# Altium project my_first_project.PrjPcb (part 3 of 3)

## Sheet POWER_Manegement.SchDoc: power manegement
size A3; Date: 23.01.2023; CompanyName: zonguldak BEU; Engineer: alperen; SheetNumber: 3; SheetTotal: 5; FIRST_PROJECT: *FIRST_PROJECT; PAGE_SİZE: *A3
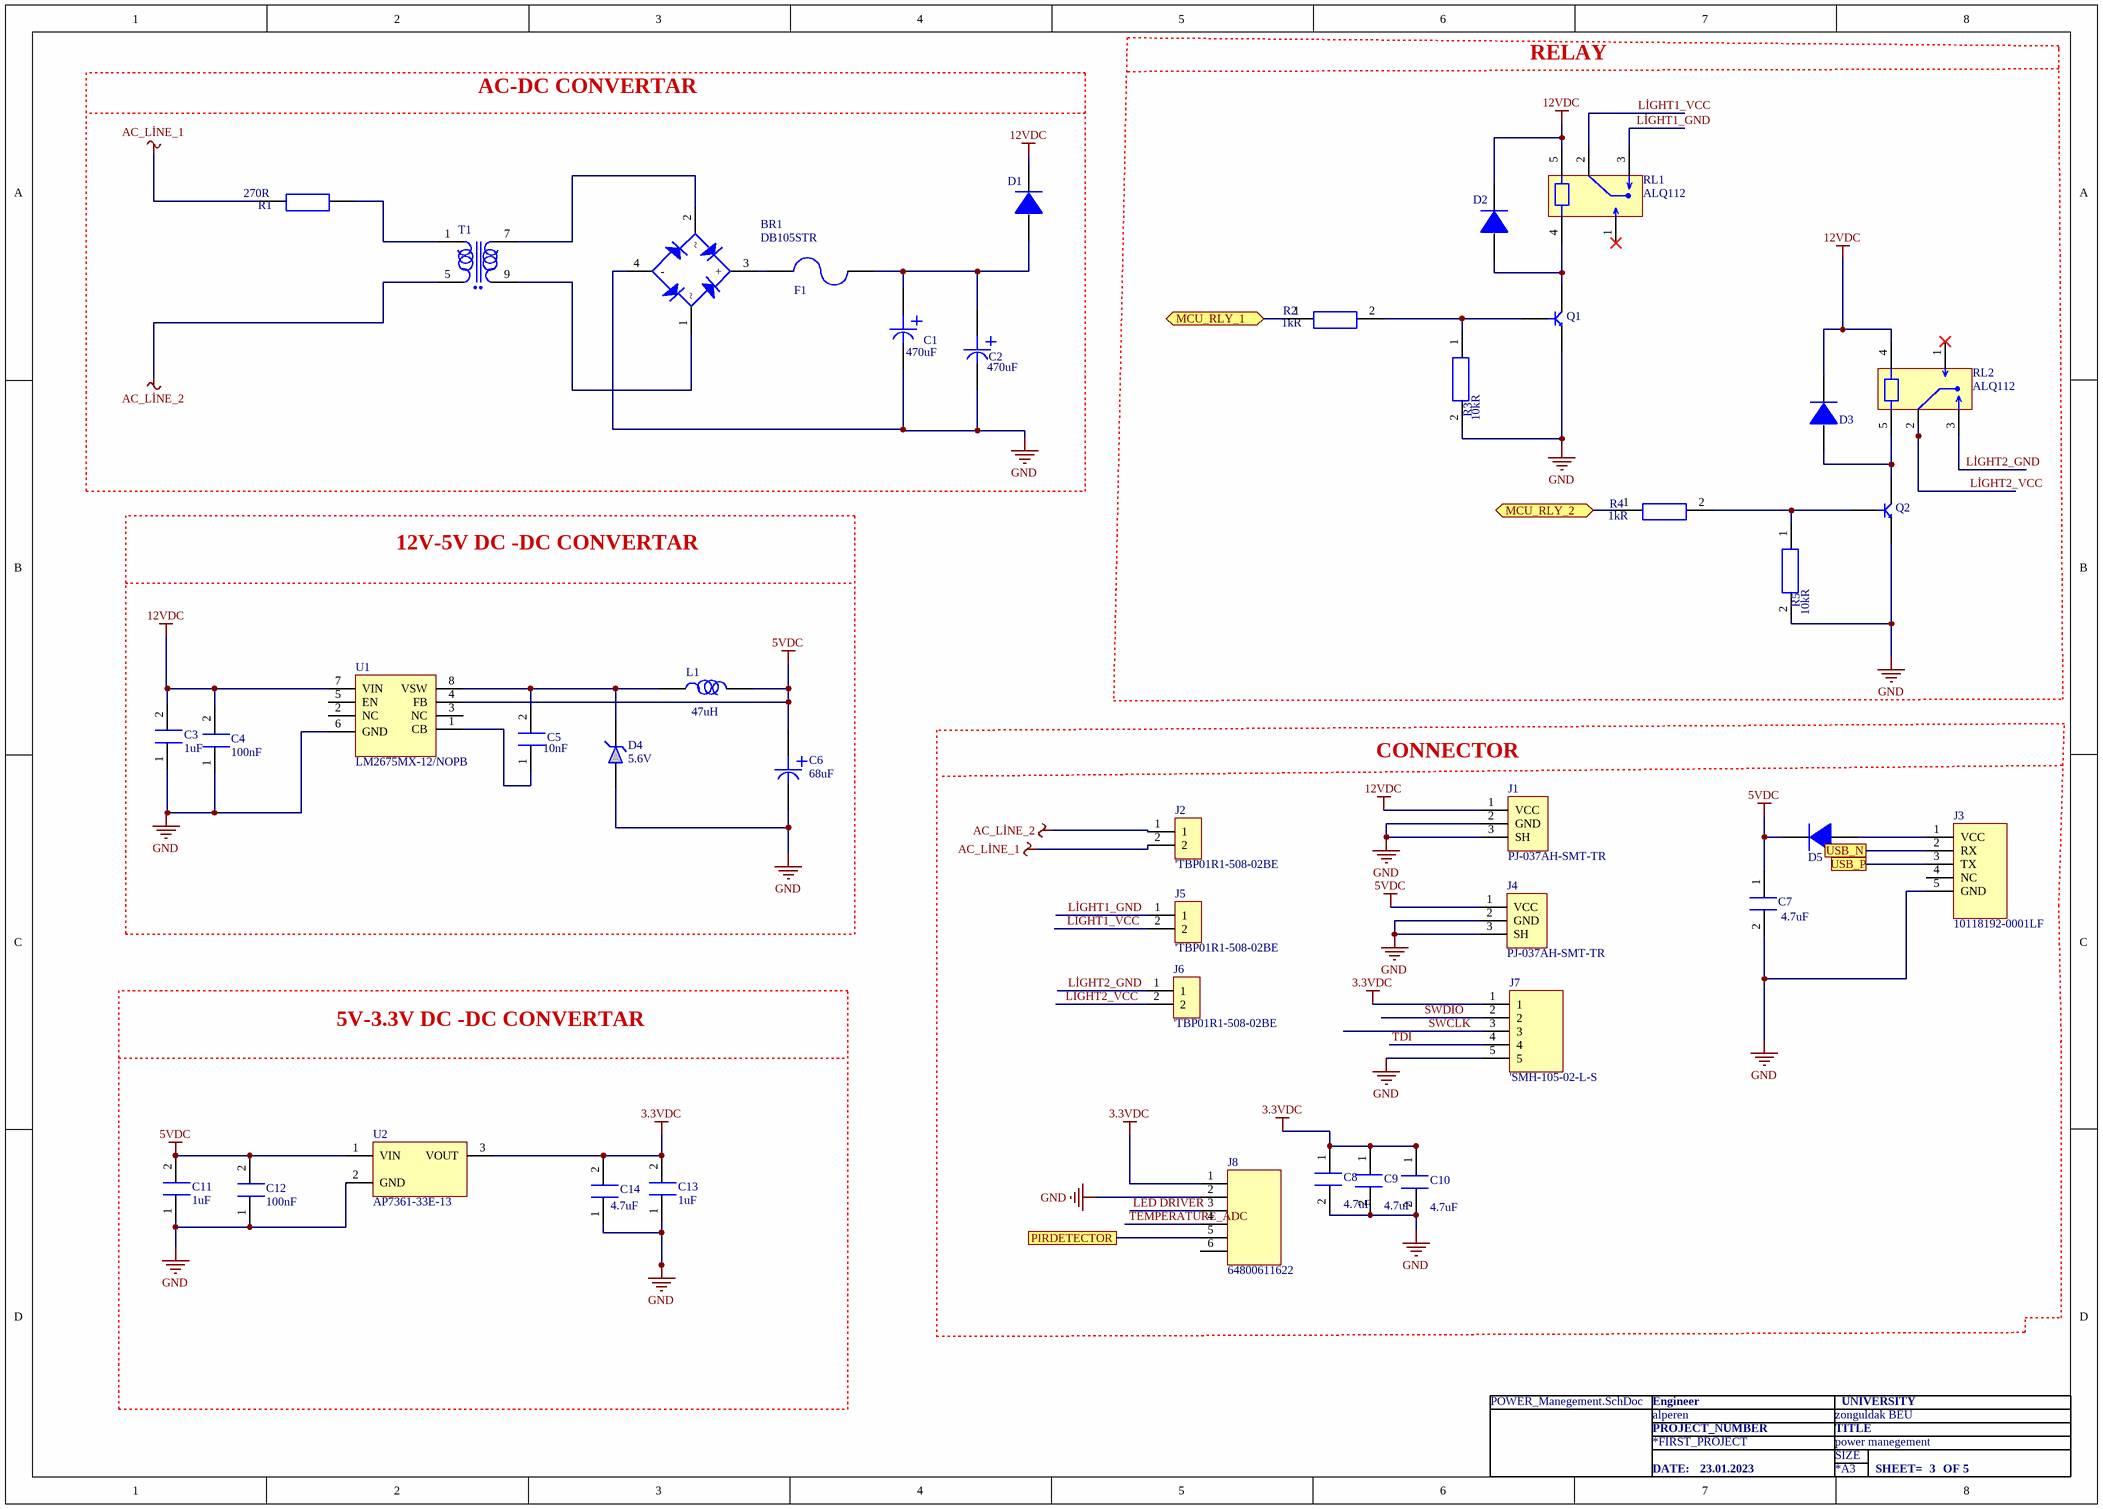
[diagram p4: POWER_Manegement.SchDoc]

### Parts
BR1  DB105STR  [DB105STR]
C1  Capacitance: 470uF  [CAP_RADIAL_D10_P5]  (hidden comment: ESH477M050AH4AA)
C2  Capacitance: 470uF  [CAP_RADIAL_D10_P5]  (hidden comment: ESH477M050AH4AA)
C3  Capacitance: 1uF  [CAP_0805]  (hidden comment: CAP CER 1UF 0805)
C4  Capacitance: 100nF  [CAP_0805]  (hidden comment: CAP CF 100NF 0805)
C5  Capacitance: 10nF  [CAP_0603]  (hidden comment: CAP CER 10nF 0603)
C6  Capacitance: 68uF  [CAP_EEVseries]  (hidden comment: EEV686M035A9HAA)
C7  Capacitance: 4.7uF  [CAP_0805]  (hidden comment: CAP CER 4.7uF 0805)
C8  Capacitance: 4.7uF  [CAP_0805]  (hidden comment: CAP CER 4.7uF 0805)
C9  Capacitance: 4.7uF  [CAP_0805]  (hidden comment: CAP CER 4.7uF 0805)
C10  Capacitance: 4.7uF  [CAP_0805]  (hidden comment: CAP CER 4.7uF 0805)
C11  Capacitance: 1uF  [CAP_0805]  (hidden comment: CAP CER 1UF 0805)
C12  Capacitance: 100nF  [CAP_0805]  (hidden comment: CAP CF 100NF 0805)
C13  Capacitance: 1uF  [CAP_0805]  (hidden comment: CAP CER 1UF 0805)
C14  Capacitance: 4.7uF  [CAP_0805]  (hidden comment: CAP CER 4.7uF 0805)
D1  1N4148WS  [SOD323]  (value not drawn)
D2  1N4148WS  [SOD323]  (value not drawn)
D3  1N4148WS  [SOD323]  (value not drawn)
D4  Zener Voltage: 5.6V  [SMB]  (hidden comment: 1SMB5919BT3G)
D5  1N4148WS  [SOD323]  (value not drawn)
F1  FUSE 3413.0216.22  [FUSE 3413.0216.22]  (value not drawn)
J1  PJ-037AH-SMT-TR  [JACK]
J2  'TBP01R1-508-02BE  ['TBP01R1-508]
J3  10118192-0001LF  [MICRO_B_USB]
J4  PJ-037AH-SMT-TR  [JACK]
J5  'TBP01R1-508-02BE  ['TBP01R1-508]
J6  'TBP01R1-508-02BE  ['TBP01R1-508]
J7  'SMH-105-02-L-S  [PINHEADER 1X5_RA]
J8  64800611622  [64800611622]
L1  Inductance: 47uH  [IND_1212]  (hidden comment: 78438335470)
Q1  MMBT3904-7-F  [SOT-23F]  (value not drawn)
Q2  MMBT3904-7-F  [SOT-23F]  (value not drawn)
R1  Resistance: 270R  [RES_AXIAL_W]  (hidden comment: RES_AXIAL_W)
R2  Resistance: 1kR  [RES_0603]  (hidden comment: RES_1KOHM)
R3  Resistance: 10kR  [RES_0603]  (hidden comment: RES 10KOHM%1 0603)
R4  Resistance: 1kR  [RES_0603]  (hidden comment: RES_1KOHM)
R5  Resistance: 10kR  [RES_0603]  (hidden comment: RES 10KOHM%1 0603)
RL1  ALQ112  [ALQ112]
RL2  ALQ112  [ALQ112]
T1  BV302S12010-ZU  [BV302S12010-ZU]  (value not drawn)
U1  LM2675MX-12/NOPB  [SOIC8]
U2  AP7361-33E-13  [SOT-223]

### Blocks framed on the sheet
RELAY: D2 D3 Q1 Q2 R2-R5 RL1 RL2
AC-DC CONVERTAR: BR1 C1 C2 D1 F1 R1 T1
12V-5V DC -DC CONVERTAR: C3-C6 D4 L1 U1
5V-3.3V DC -DC CONVERTAR: C11-C14 U2

### Ports
MCU_RLY_1 (bidir), MCU_RLY_2 (bidir), PIRDETECTOR, USB_N, USB_P

### Nets
3.3VDC: C8.1 C9.1 C10.1 C13.2 C14.2 J7.1 J8.1(VCC) U2.3(VOUT)
5VDC: C6.1 C7.1 C11.2 C12.2 D5.1 J4.1(VCC) L1.2 U1.4(FB) U2.1(VIN)
12VDC: C3.2 C4.2 D1.1 D2.1 D3.1 J1.1(VCC) RL1.5 RL2.4 U1.7(VIN)
AC_LİNE_1: J2.2 R1.1
AC_LİNE_2: J2.1 T1.5
GND: BR1.4(-) C1.2 C2.2 C3.1 C4.1 C6.2 C7.2 C8.2 C9.2 C10.2 C11.1 C12.1 C13.1 C14.1 D4.C J1.2(GND) J1.3(SH) J3.5(GND) J4.2(GND) J4.3(SH) J7.5 J8.2(RX) Q1.2(E) Q2.2(E) R3.2 R5.2 U1.6(GND) U2.2(GND)
LED DRIVER: J8.3(TX)
LİGHT1_GND: J5.1 RL1.3
LİGHT1_VCC: J5.2 RL1.2
LİGHT2_GND: J6.1 RL2.3
LİGHT2_VCC: J6.2 RL2.2
SWCLK: J7.3
SWDIO: J7.2
TDI: J7.4
TEMPERATURE_ADC: J8.4(NC)
USB_N: J3.2(RX) ; port USB_N
USB_P: J3.3(TX) ; port USB_P
NetBR1_1: BR1.1 T1.9
NetBR1_2: BR1.2 T1.7
NetBR1_3: BR1.3(+) F1.1
NetC1_1: C1.1 C2.1 D1.2 F1.2
NetC5_1: C5.1 U1.1(CB)
NetC5_2: C5.2 D4.A L1.1 U1.8(VSW)
NetD2_2: D2.2 Q1.3(C) RL1.4
NetD3_2: D3.2 Q2.3(C) RL2.5
NetD5_2: D5.2 J3.1(VCC)
NetJ8_5: J8.5(GND) ; port PIRDETECTOR
NetQ1_1: Q1.1(B) R2.2 R3.1
NetQ2_1: Q2.1(B) R4.2 R5.1
NetR1_2: R1.2 T1.1
NetR2_1: R2.1 ; port MCU_RLY_1
NetR4_1: R4.1 ; port MCU_RLY_2

Not connected (* = marked no-connect by the designer): J3 4(NC); J8 6(GND); RL1 1*; RL2 1*; U1 2(NC) 3(NC) 5(EN)

### Notes on the sheet
- AC_LİNE_1 >> 230V_50Hz
- CONNECTOR
- programlama connector
- Engineer
- PROJECT_NUMBER
- SIZE
- TITLE
- UNIVERSITY
- DATE:
- SHEET=
- OF

### Library data of the parts
BR1 = DB105STR: Bridge Rect 1PHASE 600V 1A Db-s; Manufacturer: Sangdest Microelectronics; Manufacturer Part Number: DB105S; this part is design: alperen; Supplier 1: Digi-Key; RoHS: No; Category: Uncategorized; Stock 1: 26309; Pricing 1: 1=0.43000, 10=0.32600, 100=0.20330, 500=0.13910 (USD); Supplier Part Number 1: 1655-DB105SCT-ND; Maxımum Current: 1A; Operating Voltage: 600V; ComponentLink1Description: DATASHEET; ComponentLink1URL: https://www.digikey.com/en/products/detail/smc-diode-solutions/DB105S/7244776; Case/package: DB195STR
C1 C2 = ESH477M050AH4AA: Cap, 470UF, 50V, Alu Elec, Radial; Manufacturer: KEMET; this part is design: alperen; Polarity: Polar; Tolerance: 20%; Life (Hours): 2000Hour; Supplier 1: Digi-Key; Manufacturer Part Number: ESH477M050AH4AA; RoHS: Yes; Pricing 1: 1=0.73000, 10=0.51800, 50=0.39180, 100=0.34120, 500=0.25276, 1000=0.21485, 2500=0.20222, 5000=0.18958 (USD); Mount: Through Hole; Case/Package: Radial; Min Operating Temperature: -40°C; Max Operating Temperature: 105°C; Packaging: Bulk; Voltage Rating: 50V; RoHS Compliant: No; ComponentLink1URL: https://api.kemet.com/component-edge/download/datasheet/ESH477M050AH4AA.pdf?src-supplier=Digi-Key; ComponentLink1Description: https://api.kemet.com/component-edge/download/datasheet/ESH477M050AH4AA.pdf?src-supplier=Digi-Key; Supplier Part Number 1: 399-15683-ND
C3 C11 C13 = CAP CER 1UF 0805: CAP CER 1UF 25V X5R 0805; Manufacturer: Murata; Manufacturer Part Number: GRM216R61E105KA12D; this part is design: alperen; Material: Ceramic; Tolerance: 10%; Supplier 1: Digi-Key; RoHS: Yes; Category: Ceramic Capacitors; Stock 1: 601950; Pricing 1: 1=0.38000, 10=0.26600, 50=0.18640, 100=0.15970, 500=0.11980, 1000=0.10116 (USD); Mount: Surface Mount; Case/Package: 0805; Number of Pins: 2; Case Code (Imperial): 0805; Case Code (Metric): 2012; Min Operating Temperature: -55°C; Max Operating Temperature: 85°C; Voltage Rating: 25V; Packaging: Tape and Reel; Dielectric: X5R; Package Quantity: 1; Termination: SMD/SMT; Voltage Rating (DC): 25V; Series: GRM; Construction: Flat; Voltage: 25V; Length: 2mm; Width: 1.25mm; Height: 0.6mm; Thickness: 0.028inch; Depth: 1.25mm; Radiation Hardening: No; RoHS Compliant: Yes; Lead Free: Lead Free; Reach SVHC Compliant: Yes; ComponentLink1URL: https://datasheet.ciiva.com/5424/product-5424880.pdf?src-supplier=Mouser; ComponentLink1Description: https://datasheet.ciiva.com/5424/product-5424880.pdf?src-supplier=Mouser; ComponentLink2URL: https://datasheet.ciiva.com/3777/337grm216r61e105ka1223-3777289.pdf?src-supplier=Arrow+Electronics; ComponentLink2Description: https://datasheet.ciiva.com/3777/337grm216r61e105ka1223-3777289.pdf?src-supplier=Arrow+Electronics; ComponentLink3URL: https://datasheet.ciiva.com/11787/0900766b80ef921d-11787891.pdf?src-supplier=Rs; ComponentLink3Description: https://datasheet.ciiva.com/11787/0900766b80ef921d-11787891.pdf?src-supplier=Rs; ComponentLink4URL: https://datasheet.ciiva.com/7719/c02e-7719049.pdf?src-supplier=Element14; ComponentLink4Description: https://datasheet.ciiva.com/7719/c02e-7719049.pdf?src-supplier=Element14; ComponentLink5URL: https://datasheet.ciiva.com/22706/1889704-22706791.pdf?src-supplier=Element14; ComponentLink5Description: https://datasheet.ciiva.com/22706/1889704-22706791.pdf?src-supplier=Element14; ComponentLink6URL: https://datasheet.ciiva.com/138/partnumbering-e-01-138518.pdf?src-supplier=Digi-Key; ComponentLink6Description: https://datasheet.ciiva.com/138/partnumbering-e-01-138518.pdf?src-supplier=Digi-Key; ComponentLink7URL: https://datasheet.ciiva.com/138/partnumbering-e-01-138517.pdf?src-supplier=Digi-Key; ComponentLink7Description: https://datasheet.ciiva.com/138/partnumbering-e-01-138517.pdf?src-supplier=Digi-Key; ComponentLink8URL: https://datasheet.ciiva.com/138/partnumbering-e-01-138519.pdf?src-supplier=Digi-Key; ComponentLink8Description: https://datasheet.ciiva.com/138/partnumbering-e-01-138519.pdf?src-supplier=Digi-Key; ComponentLink9URL: https://datasheet.ciiva.com/2989/product-2989638.pdf?src-supplier=Avnet; ComponentLink9Description: https://datasheet.ciiva.com/2989/product-2989638.pdf?src-supplier=Avnet; Supplier Part Number 1: 490-1700-1-ND
C4 C12 = CAP CF 100NF 0805: CAP CER 0.1UF 50V X7R 0805; Manufacturer: Samsung; Manufacturer Part Number: CL21B104KBCNNNC; this part is design: alperen; Material: Ceramic; Tolerance: 10%; Supplier 1: Digi-Key; RoHS: Yes; Category: Ceramic Capacitors; Stock 1: 3449370; Pricing 1: 1=0.10000, 10=0.04400, 50=0.02400, 100=0.01960, 500=0.01404, 1000=0.01103 (USD); Mount: Surface Mount; Case/Package: 0805; Case Code (Metric): 2012; Case Code (Imperial): 0805; Contact Plating: Tin; Min Operating Temperature: -55°C; Max Operating Temperature: 125°C; Dielectric: X7R; Packaging: Tape and Reel; Voltage Rating: 50V; Voltage: 50V; Voltage Rating (DC): 50V; Series: CL; Construction: Flat; Length: 2mm; Width: 0.049inch; Height: 0.85mm; Depth: 1.25mm; Thickness: 0.037inch; Radiation Hardening: No; Lead Free: Lead Free; RoHS Compliant: Yes; ComponentLink1URL: https://datasheet.ciiva.com/25710/cl21b104kbcnnnc-25710182.pdf?src-supplier=Digi-Key; ComponentLink1Description: https://datasheet.ciiva.com/25710/cl21b104kbcnnnc-25710182.pdf?src-supplier=Digi-Key; ComponentLink2URL: https://datasheet.ciiva.com/29199/454152-da-01-en-vs-kondensator-0805-29199814.pdf?src-supplier=Conrad; ComponentLink2Description: https://datasheet.ciiva.com/29199/454152-da-01-en-vs-kondensator-0805-29199814.pdf?src-supplier=Conrad; Supplier Part Number 1: 1276-1003-1-ND
C5 = CAP CER 10nF 0603: Multilayer Ceramic Capacitor, 0.01 F, 10%, X7R, 16 V, 0603 [1608 Metric] RoHS Compliant: Yes; Manufacturer: Walsin Technologies; Manufacturer Part Number: 0603B103K160CT; this part is design: alperen; Voltage Rating: 16V; Supplier 1: Digi-Key; RoHS: Yes; Category: Ceramic Capacitors; Stock 1: 152993; Pricing 1: 1=0.10000, 10=0.03300, 50=0.01820, 100=0.01480, 500=0.01060, 1000=0.00833 (USD); Case/Package: 0603; Case Code (Metric): 1608; Case Code (Imperial): 0603; Min Operating Temperature: -55°C; Max Operating Temperature: 125°C; Tolerance: 10%; Packaging: Tape and Reel; Dielectric: X7R; Voltage Rating (DC): 16V; Length: 1.6mm; Depth: 0.8mm; RoHS Compliant: Yes; ComponentLink1URL: http://www.farnell.com/datasheets/1958513.pdf?src-supplier=Farnell; ComponentLink1Description: http://www.farnell.com/datasheets/1958513.pdf?src-supplier=Farnell; ComponentLink2URL: http://www.farnell.com/datasheets/1958513.pdf?src-supplier=Element14; ComponentLink2Description: http://www.farnell.com/datasheets/1958513.pdf?src-supplier=Element14; ComponentLink3URL: http://www.passivecomponent.com/wp-content/uploads/2018/10/MLCC.pdf?src-supplier=Digi-Key; ComponentLink3Description: http://www.passivecomponent.com/wp-content/uploads/2018/10/MLCC.pdf?src-supplier=Digi-Key; Supplier Part Number 1: 1292-1384-1-ND
C6 = CAP ALU 68uF: Cap Aluminum Lytic 68uF 35V 20% (6.3 X 7.7mm) SMD 280mA 2000h 105C T/R; this part is designed: alperen; Manufacturer: KEMET; Impedance: 340mR; Ripple Current: 196mA; Life (Hours): 2000Hour; Supplier 1: Digi-Key; Manufacturer Part Number: EEV686M035A9HAA; RoHS: Yes; Category: Aluminum Electrolytic Capacitors; Stock 1: 4857; Pricing 1: 1=0.67000, 10=0.47200, 50=0.35680, 100=0.31080, 500=0.23024 (USD); Mount: Surface Mount; Case/Package: Radial; Min Operating Temperature: -40°C; Max Operating Temperature: 105°C; Packaging: Tape and Reel; Package Quantity: 1; Voltage Rating: 35V; Tolerance: 20%; Voltage Rating (DC): 35V; Termination: SMD/SMT; Series: EEV; Length: 7.7mm; Height - Seated (Max): 0.315inch; RoHS Compliant: Yes; ComponentLink1URL: https://datasheet.ciiva.com/5365/kem-a4002-eev-535332-5365784.pdf?src-supplier=Mouser; ComponentLink1Description: https://datasheet.ciiva.com/5365/kem-a4002-eev-535332-5365784.pdf?src-supplier=Mouser; Supplier Part Number 1: 399-6722-1-ND
C7-C10 C14 = CAP CER 4.7uF 0805: CAP CER 4.7UF 25V X5R 0805; Manufacturer: Samsung; Manufacturer Part Number: CL21A475KAQNNNE; this part is design: alperen; Tolerance: 10%; Supplier 1: Digi-Key; RoHS: Yes; Category: Ceramic Capacitors; Stock 1: 4696474; Pricing 1: 1=0.10000, 10=0.07300, 50=0.04140, 100=0.03440, 500=0.02408, 1000=0.01994 (USD); Mount: Surface Mount; Case/Package: 0805; Case Code (Metric): 2012; Case Code (Imperial): 0805; Min Operating Temperature: -55°C; Max Operating Temperature: 85°C; Package Quantity: 1; Packaging: Tape and Reel; Voltage Rating: 25V; Dielectric: X5R; Voltage Rating (DC): 25V; Series: CL; Construction: Flat; Length: 2mm; Width: 0.049inch; Height: 1.25mm; Thickness: 0.055inch; Depth: 1.25mm; Radiation Hardening: No; Lead Free: Lead Free; RoHS Compliant: Yes; ComponentLink1URL: https://datasheet.ciiva.com/25798/cl21a475kaqnnne-25798882.pdf?src-supplier=Digi-Key; ComponentLink1Description: https://datasheet.ciiva.com/25798/cl21a475kaqnnne-25798882.pdf?src-supplier=Digi-Key; Supplier Part Number 1: 1276-1244-6-ND
D1-D3 D5 = 1N4148WS: VR=75V IF=150mA Trr=4ns P=200mW; Manufacturer: ON Semiconductor / Fairchild; this part is design: alperen; Forward Current: 150mA; Reverse Recovery Time: 4ns; Max Repetitive Reverse Voltage (Vrrm): 75V; Power Dissipation: 200mW; Max Reverse Current: 5uA; Forward Voltage: 1V; Max Forward Surge Current (Ifsm): 2A; Element Configuration: Single; Supplier 1: Digi-Key; Manufacturer Part Number: 1N4148WS; RoHS: Yes; Category: Rectifier Diodes; Stock 1: 878888; Pricing 1: 1=0.21000, 10=0.19200, 100=0.10460, 500=0.06436, 1000=0.04388 (USD); Mount: Surface Mount; Number of Pins: 2; Contact Plating: Tin,Matte; Weight: 0.0276g; Min Operating Temperature: -55°C; Max Operating Temperature: 150°C; Packaging: Tape and Reel; Package Quantity: 1; Recovery Time: 4ns; Average Rectified Current: 150mA; Reverse Voltage: 75V; Max Reverse Voltage (DC): 75V; Series: -; Length: 1.8mm; Width: 1.35mm; Height: 1mm; Radiation Hardening: No; Reach SVHC Compliant: Yes; Lead Free: Lead Free; RoHS Compliant: Yes; ComponentLink1URL: https://datasheet.ciiva.com/15208/getdatasheetpartid-127819-15208358.pdf?src-supplier=Verical; ComponentLink1Description: https://datasheet.ciiva.com/15208/getdatasheetpartid-127819-15208358.pdf?src-supplier=Verical; ComponentLink2URL: https://datasheet.ciiva.com/8300/1n914bws-8300360.pdf?src-supplier=Avnet; ComponentLink2Description: https://datasheet.ciiva.com/8300/1n914bws-8300360.pdf?src-supplier=Avnet; Supplier Part Number 1: 1N4148WSFSCT-ND
D4 = 1SMB5919BT3G: Vz=5.6V 5.32V~5.88V Izt=66.9mA; this part is design: alperen; Manufacturer: ON Semiconductor; Material: Plastic; Max Power Dissipation: 3W; Tolerance: 5%; Max Reverse Leakage Current: 5uA; Impedance: 2R; Element Configuration: Single; Forward Voltage: 1.5V; Power Dissipation: 550mW; Zener Current: 267mA; Test Current: 66.9mA; Breakdown Voltage: 5.88V; ESD Protection: Yes; Supplier 1: Rs; Manufacturer Part Number: 1SMB5919BT3G; RoHS: Yes; Category: Zener Diodes; Stock 1: 1; Case/Package: SMB; Number of Pins: 2; Contact Plating: Tin,Matte; Min Operating Temperature: -65°C; Max Operating Temperature: 150°C; Package Quantity: 2500; Packaging: Tape and Reel; Voltage Tolerance: 5%; Series: -; Working Voltage: 5.6V; Max Reverse Current: 5uA; Voltage Rating (DC): 5.6V; Power Rating: 3W; Length: 4.32mm; Width: 3.56mm; Height: 2.13mm; Radiation Hardening: No; Lead Free: Lead Free; Halogen Free: Halogen Free; RoHS Compliant: Yes; Reach SVHC Compliant: Yes; ComponentLink1URL: https://datasheet.ciiva.com/27747/1308331-27747654.pdf?src-supplier=Jameco; ComponentLink1Description: https://datasheet.ciiva.com/27747/1308331-27747654.pdf?src-supplier=Jameco; ComponentLink2URL: https://datasheet.ciiva.com/1182/1smb5913bt3-d-1182657.pdf?src-supplier=Element14; ComponentLink2Description: https://datasheet.ciiva.com/1182/1smb5913bt3-d-1182657.pdf?src-supplier=Element14; ComponentLink3URL: https://datasheet.ciiva.com/1182/1smb5913bt3-d-1182658.pdf?src-supplier=Element14; ComponentLink3Description: https://datasheet.ciiva.com/1182/1smb5913bt3-d-1182658.pdf?src-supplier=Element14; ComponentLink4URL: https://datasheet.ciiva.com/16311/1smb5913bt3-d-16311847.pdf?src-supplier=Future+Electronics; ComponentLink4Description: https://datasheet.ciiva.com/16311/1smb5913bt3-d-16311847.pdf?src-supplier=Future+Electronics; ComponentLink5URL: https://datasheet.ciiva.com/15198/getdatasheetpartid-311040-15198695.pdf?src-supplier=Verical; ComponentLink5Description: https://datasheet.ciiva.com/15198/getdatasheetpartid-311040-15198695.pdf?src-supplier=Verical; ComponentLink6URL: https://datasheet.ciiva.com/895/1smb5913bt3-d-895204.pdf?src-supplier=Digi-Key; ComponentLink6Description: https://datasheet.ciiva.com/895/1smb5913bt3-d-895204.pdf?src-supplier=Digi-Key; ComponentLink7URL: https://datasheet.ciiva.com/895/1smb5913bt3-d-895205.pdf?src-supplier=Digi-Key; ComponentLink7Description: https://datasheet.ciiva.com/895/1smb5913bt3-d-895205.pdf?src-supplier=Digi-Key; ComponentLink8URL: https://datasheet.ciiva.com/895/1smb5913bt3-d-895203.pdf?src-supplier=Digi-Key; ComponentLink8Description: https://datasheet.ciiva.com/895/1smb5913bt3-d-895203.pdf?src-supplier=Digi-Key; Supplier Part Number 1: 5453320
F1 = FUSE 3413.0216.22: Fuse Chip Fast Acting 1A 32V SMD Solder Pad 1206 Glass T/R VDE/cULus; this part is design: alperen; Manufacturer: Schurter; Body Material: Glass,Epoxy; Max Voltage Rating (DC): 63V; DC Cold Resistance: 94.2mR; Fuse Type: Board Mount (Cartridge Style Excluded); Approvals: VDE,cURus; Supplier 1: Digi-Key; Manufacturer Part Number: 3413.0216.22; RoHS: Yes; Category: Fuses; Stock 1: 5000; Pricing 1: 1000=0.32625 (USD); Mount: Surface Mount,PCB; Case/Package: 1206; Number of Pins: 2; Weight: 0.000212oz; Case Code (Metric): 3216; Case Code (Imperial): 1206; Contact Plating: Gold; Housing Material: Glass; Terminal Material: Tin; Min Operating Temperature: -55°C; Max Operating Temperature: 90°C; Current Rating: 1A; Package Quantity: 1000; Voltage Rating (AC): 32V; Voltage Rating (DC): 63V; Packaging: Tape and Reel; Max Voltage Rating (AC): 32V; Voltage Rating: 32V; Termination: SMD/SMT; Working Voltage: 32V; Series: USI 1206; Length: 3.2mm; Width: 1.6mm; Height: 0.6mm; Depth: 1.6mm; Radiation Hardening: No; Lead Free: Lead Free; RoHS Compliant: Yes; ComponentLink1URL: https://datasheet.ciiva.com/301/typ-usi-1206-301440.pdf?src-supplier=Digi-Key; ComponentLink1Description: https://datasheet.ciiva.com/301/typ-usi-1206-301440.pdf?src-supplier=Digi-Key; ComponentLink2URL: https://datasheet.ciiva.com/14541/70160006-14541114.pdf?src-supplier=Allied+Electronics; ComponentLink2Description: https://datasheet.ciiva.com/14541/70160006-14541114.pdf?src-supplier=Allied+Electronics; ComponentLink3URL: https://datasheet.ciiva.com/301/typ-usi-1206-301439.pdf?src-supplier=Digi-Key; ComponentLink3Description: https://datasheet.ciiva.com/301/typ-usi-1206-301439.pdf?src-supplier=Digi-Key; ComponentLink4URL: https://datasheet.ciiva.com/301/typ-usi-1206-301441.pdf?src-supplier=Digi-Key; ComponentLink4Description: https://datasheet.ciiva.com/301/typ-usi-1206-301441.pdf?src-supplier=Digi-Key; ComponentLink5URL: https://datasheet.ciiva.com/8264/typ-usi-1206-8264583.pdf?src-supplier=Avnet; ComponentLink5Description: https://datasheet.ciiva.com/8264/typ-usi-1206-8264583.pdf?src-supplier=Avnet; ComponentLink6URL: https://datasheet.ciiva.com/14102/qousi1206-data-e-14102903.pdf?src-supplier=Distrelec; ComponentLink6Description: https://datasheet.ciiva.com/14102/qousi1206-data-e-14102903.pdf?src-supplier=Distrelec; ComponentLink7URL: https://datasheet.ciiva.com/16316/typ-usi-1206-16316588.pdf?src-supplier=Future+Electronics; ComponentLink7Description: https://datasheet.ciiva.com/16316/typ-usi-1206-16316588.pdf?src-supplier=Future+Electronics; Supplier Part Number 1: 486-1144-2-ND
J1 J4 = PJ-037AH-SMT-TR: 2.0 x 6.3 mm, 5.0 A, Horizontal, Surface Mount (SMT), Dc Power Jack Connector; this part is designed: alperen; Manufacturer: CUI; Number of Conductors: 2; Gender: Male; Shielding: Unshielded; Current Rating: 5A; Voltage Rating: 24V; Insulation Resistance: 100MR; Supplier 1: Digi-Key; Manufacturer Part Number: PJ-037AH-SMT-TR; RoHS: Yes; Category: Uncategorized; Stock 1: 114; Pricing 1: 1=1.510000, 10=1.317000, 25=1.261200, 50=1.233200, 100=1.177200 (USD); Mount: Surface Mount,Through Hole; Case/Package: SMD/SMT; Color: Black; Contact Material: Copper; Contact Plating: Nickel; Housing Color: Black; Housing Material: Thermoplastic; Min Operating Temperature: -25°C; Max Operating Temperature: 85°C; Orientation: Horizontal; Package Quantity: 200; Termination: Solder; Connector Type: Jack; Contact Gender: Male; Packaging: Tape and Reel; Flammability Rating: UL94 V-0; ComponentLink1URL: http://www.mouser.com/ds/2/670/pj-037ah-smt-516065.pdf?src-supplier=Mouser; ComponentLink1Description: http://www.mouser.com/ds/2/670/pj-037ah-smt-516065.pdf?src-supplier=Mouser; ComponentLink2URL: https://www.cui.com/product/resource/digikeypdf/pj-037ah-smt-tr.pdf?src-supplier=Digi-Key; ComponentLink2Description: https://www.cui.com/product/resource/digikeypdf/pj-037ah-smt-tr.pdf?src-supplier=Digi-Key; ComponentLink3URL: http://www.cui.com/product/resource/digikeypdf/pj-037ah-smt.pdf?src-supplier=Digi-Key; ComponentLink3Description: http://www.cui.com/product/resource/digikeypdf/pj-037ah-smt.pdf?src-supplier=Digi-Key; Supplier Part Number 1: CP-037AHPJCT-ND
J2 J5 J6 = 'TBP01R1-508-02BE: 2~24 Poles, Pluggable, Receptacle, Horizontal, 5.08 Pitch, Terminal Block Connector; this part is design: alperen; Manufacturer: CUI Devices; Supplier 1: Digi-Key; Manufacturer Part Number: TBP01R1-508-02BE; RoHS: Yes; Category: Terminal Blocks; Stock 1: 146737; Pricing 1: 1=0.56000, 10=0.29600, 25=0.20960, 50=0.17840, 100=0.17220, 250=0.14560, 500=0.13464, 1000=0.11898, 5000=0.09080 (USD); Supplier Part Number 1: 102-6406-ND
J3 = Micro B USB connector: CONN USB MICRO B RECPT SMT R/A; this part is designed: alperen; Manufacturer: Amphenol ICC / FCI; Supplier 1: Avnet; Manufacturer Part Number: 10118192-0001LF; RoHS: No; Category: USB Connectors; Stock 1: 13297; Pricing 1: 1=0.45800, 25=0.40100, 100=0.36800, 250=0.33500, 500=0.32000, 1000=0.31300, 2500=0.29700 (USD); ComponentLink1URL: http://uk.rs-online.com/webdocs/1450/0900766b814507ee.pdf?src-supplier=Rs; ComponentLink1Description: http://uk.rs-online.com/webdocs/1450/0900766b814507ee.pdf?src-supplier=Rs; ComponentLink2URL: http://www.amphenol-icc.com/media/wysiwyg/files/drawing/10118192.pdf?src-supplier=Digi-Key; ComponentLink2Description: http://www.amphenol-icc.com/media/wysiwyg/files/drawing/10118192.pdf?src-supplier=Digi-Key; ComponentLink3URL: https://cdn.amphenol-icc.com/media/wysiwyg/files/documentation/datasheet/inputoutput/io_usb_micro.pdf?src-supplier=Arrow+Electronics; ComponentLink3Description: https://cdn.amphenol-icc.com/media/wysiwyg/files/documentation/datasheet/inputoutput/io_usb_micro.pdf?src-supplier=Arrow+Electronics; ComponentLink4URL: https://cdn.amphenol-icc.com/media/wysiwyg/files/documentation/datasheet/inputoutput/io_usb_micro.pdf?src-supplier=Avnet; ComponentLink4Description: https://cdn.amphenol-icc.com/media/wysiwyg/files/documentation/datasheet/inputoutput/io_usb_micro.pdf?src-supplier=Avnet; ComponentLink5URL: http://www.farnell.com/cad/1935767.pdf?src-supplier=Element14; ComponentLink5Description: http://www.farnell.com/cad/1935767.pdf?src-supplier=Element14; ComponentLink6URL: https://cdn.amphenol-icc.com/media/wysiwyg/files/documentation/datasheet/inputoutput/io_usb_micro.pdf?src-supplier=Allied+Electronics; ComponentLink6Description: https://cdn.amphenol-icc.com/media/wysiwyg/files/documentation/datasheet/inputoutput/io_usb_micro.pdf?src-supplier=Allied+Electronics; ComponentLink7URL: https://cdn.amphenol-icc.com/media/wysiwyg/files/documentation/datasheet/inputoutput/io_usb_micro.pdf?src-supplier=Mouser; ComponentLink7Description: https://cdn.amphenol-icc.com/media/wysiwyg/files/documentation/datasheet/inputoutput/io_usb_micro.pdf?src-supplier=Mouser; ComponentLink8URL: https://cdn.amphenol-icc.com/media/wysiwyg/files/documentation/datasheet/inputoutput/io_usb_micro.pdf?src-supplier=Verical; ComponentLink8Description: https://cdn.amphenol-icc.com/media/wysiwyg/files/documentation/datasheet/inputoutput/io_usb_micro.pdf?src-supplier=Verical; ComponentLink9URL: http://www.farnell.com/datasheets/2366786.pdf?src-supplier=Newark; ComponentLink9Description: http://www.farnell.com/datasheets/2366786.pdf?src-supplier=Newark; ComponentLink10URL: http://www.farnell.com/datasheets/2366786.pdf?src-supplier=Farnell; ComponentLink10Description: http://www.farnell.com/datasheets/2366786.pdf?src-supplier=Farnell; ComponentLink11URL: https://cdn.amphenol-icc.com/media/wysiwyg/files/documentation/datasheet/inputoutput/io_usb_micro.pdf?src-supplier=NAC+Semi; ComponentLink11Description: https://cdn.amphenol-icc.com/media/wysiwyg/files/documentation/datasheet/inputoutput/io_usb_micro.pdf?src-supplier=NAC+Semi; ComponentLink12URL: https://cdn.amphenol-icc.com/media/wysiwyg/files/documentation/datasheet/inputoutput/io_usb_micro.pdf?src-supplier=Freelance+Electronics; ComponentLink12Description: https://cdn.amphenol-icc.com/media/wysiwyg/files/documentation/datasheet/inputoutput/io_usb_micro.pdf?src-supplier=Freelance+Electronics; ComponentLink13URL: https://cdn.amphenol-icc.com/media/wysiwyg/files/documentation/datasheet/inputoutput/io_usb_micro.pdf?src-supplier=Heilind+Electronics; ComponentLink13Description: https://cdn.amphenol-icc.com/media/wysiwyg/files/documentation/datasheet/inputoutput/io_usb_micro.pdf?src-supplier=Heilind+Electronics; ComponentLink14URL: https://cdn.amphenol-icc.com/media/wysiwyg/files/documentation/datasheet/inputoutput/io_usb_micro.pdf?src-supplier=TME; ComponentLink14Description: https://cdn.amphenol-icc.com/media/wysiwyg/files/documentation/datasheet/inputoutput/io_usb_micro.pdf?src-supplier=TME; ComponentLink15URL: https://cdn.amphenol-icc.com/media/wysiwyg/files/documentation/datasheet/inputoutput/io_usb_micro.pdf?src-supplier=TTI; ComponentLink15Description: https://cdn.amphenol-icc.com/media/wysiwyg/files/documentation/datasheet/inputoutput/io_usb_micro.pdf?src-supplier=TTI; ComponentLink16URL: https://cdn.amphenol-icc.com/media/wysiwyg/files/documentation/datasheet/inputoutput/io_usb_micro.pdf?src-supplier=SOS+electronic; ComponentLink16Description: https://cdn.amphenol-icc.com/media/wysiwyg/files/documentation/datasheet/inputoutput/io_usb_micro.pdf?src-supplier=SOS+electronic; Supplier Part Number 1: 67T2258
J7 = SMH-105-02-L-S: .100 C.L. HORIZONTAL SMT SOCKET; this part is designed: alperen; Manufacturer: Samtec; Number of Contacts: 5; Gender: Receptacle; Contact Resistance: 10mR; Pitch: 2.54mm; Supplier 1: Digi-Key; Manufacturer Part Number: SMH-105-02-L-S; RoHS: Yes; Category: Connectors; Stock 1: 206; Pricing 1: 1=2.18000, 10=1.89900, 100=1.69680, 500=1.41400, 1000=1.21200, 5000=1.07464 (USD); Contact Plating: Gold; Contact Material: Bronze; Housing Color: Black; Housing Material: Polymer; Contact Finish - Mating: GOLD; Insulation Color: Black; Insulation Material: Polymer; Contact Shape: Square; Min Operating Temperature: -55°C; Max Operating Temperature: 125°C; Packaging: Rail/Tube; Number of Rows: 1; Termination: Solder; Orientation: Horizontal; Connector Type: Receptacle; Fastening Type: Pull; Series: SMH; Contact Type: Forked; Number of Positions: 5; Length: 13.21mm; Depth: 10.8mm; Radiation Hardening: No; RoHS Compliant: Yes; Reach SVHC Compliant: Yes; Flammability Rating: UL94 V-0; ComponentLink1URL: http://www.farnell.com/datasheets/1927708.pdf?_ga=2.237598468.569325269.1503285096-1413671594.1503025027&src-supplier=Farnell; ComponentLink1Description: http://www.farnell.com/datasheets/1927708.pdf?_ga=2.237598468.569325269.1503285096-1413671594.1503025027&src-supplier=Farnell; ComponentLink2URL: http://www.samtec.com/documents/webfiles/pdf/SMH.PDF?src-supplier=Newark; ComponentLink2Description: http://www.samtec.com/documents/webfiles/pdf/SMH.PDF?src-supplier=Newark; ComponentLink3URL: http://www.samtec.com/documents/webfiles/pdf/SMH.PDF?src-supplier=Avnet; ComponentLink3Description: http://www.samtec.com/documents/webfiles/pdf/SMH.PDF?src-supplier=Avnet; ComponentLink4URL: http://suddendocs.samtec.com/catalog_english/smh.pdf?src-supplier=Digi-Key; ComponentLink4Description: http://suddendocs.samtec.com/catalog_english/smh.pdf?src-supplier=Digi-Key; Supplier Part Number 1: SAM11813-ND
J8 = 64800611622_CONN_6PİN: Conn, Header, 6POS, 1ROW, 1.5MM;; Manufacturer: Wurth Electronics; this part is designed: alperen; Supplier 1: DigiKey; Manufacturer Part Number: 64800611622; RoHS: No; Pricing 1: 1=0.42000, 50=0.40600, 100=0.38400, 250=0.36100, 500=0.33900 (USD); Supplier Part Number 1: 732-64800611622-ND
L1 = IND 47uH: Fixed Ind 47UH 390MA 2.3 Ohm SMD; this part is design: alperen; Manufacturer: Wurth Electronics; Core Material: Ferrite; Saturation Current: 1.18A; Shielding: Shielded; DC Resistance (DCR): 2.3R; Self Resonant Frequency: 8MHz; Test Frequency: 100kHz; Tolerance: 30%; Supplier 1: Farnell; Manufacturer Part Number: 78438335470; RoHS: Yes; Category: Fixed Inductors; Stock 1: 1707; Pricing 1: 1=2.11000, 50=1.97000, 100=1.89000, 250=1.81000, 500=1.68000, 1000=1.67000, 5000=1.64000 (EUR); Mount: Surface Mount; Case/Package: 1212; Case Code (Metric): 3030; Case Code (Imperial): 1212; Min Operating Temperature: -40°C; Max Operating Temperature: 125°C; Packaging: Tape and Reel; Resistor Type: Wirewound; Current Rating: 390mA; Length: 0.118inch; Width: 0.118inch; Height - Seated (Max): 0.059inch; Ratings: AEC-Q200; RoHS Compliant: Yes; ComponentLink1URL: https://media.digikey.com/pdf/Data%20Sheets/Wurth%20Electronics%20PDFs/Q+_Products_Flyer.pdf?src-supplier=Digi-Key; ComponentLink1Description: https://media.digikey.com/pdf/Data%20Sheets/Wurth%20Electronics%20PDFs/Q+_Products_Flyer.pdf?src-supplier=Digi-Key; Supplier Part Number 1: 3517060
Q1 Q2 = MMBT3904-7-F: NPN Ic=200mA Vceo=40V hfe=100~300 fT=310MHz P=300mW SOT-23; this part is designed: alperen; Manufacturer: Diodes Zetex; Max Power Dissipation: 300mW; Collector Emitter Voltage (VCEO): 40V; Max Collector Current: 200mA; Collector Base Voltage (VCBO): 60V; Power Dissipation: 350mW; Frequency: 300MHz; hFE Min: 100; Number of Elements: 1; Emitter Base Voltage (VEBO): 6V; Collector Emitter Saturation Voltage: 300mV; Element Configuration: Single; Supplier 1: Digi-Key; Manufacturer Part Number: MMBT3904-7-F; RoHS: Yes; Category: BJTs; Stock 1: 7702566; Pricing 1: 1=0.13000, 10=0.11700, 100=0.06370, 500=0.03918, 1000=0.02671 (USD); Mount: Surface Mount; Case/Package: SOT-23; Number of Pins: 3; Weight: 0.000282oz; Contact Plating: Tin,Matte; Min Operating Temperature: -55°C; Max Operating Temperature: 150°C; Polarity: NPN; Packaging: Tape and Reel; Package Quantity: 3000; Transition Frequency: 300MHz; Collector Emitter Breakdown Voltage: 40V; Max Breakdown Voltage: 40V; Continuous Collector Current: 200mA; Max Frequency: 300MHz; Gain Bandwidth Product: 300MHz; Voltage Rating (DC): 40V; Series: Automotive, AEC-Q101; Collector-emitter Voltage-Max: 300mV; Length: 3.05mm; Width: 1.4mm; Height: 1mm; Radiation Hardening: No; Reach SVHC Compliant: Yes; Lead Free: Lead Free; RoHS Compliant: Yes; ComponentLink1URL: https://datasheet.ciiva.com/11201/ds30036-11201778.pdf?src-supplier=Avnet; ComponentLink1Description: https://datasheet.ciiva.com/11201/ds30036-11201778.pdf?src-supplier=Avnet; ComponentLink2URL: https://datasheet.ciiva.com/15138/getdatasheetpartid-53265-15138780.pdf?src-supplier=Verical; ComponentLink2Description: https://datasheet.ciiva.com/15138/getdatasheetpartid-53265-15138780.pdf?src-supplier=Verical; ComponentLink3URL: https://datasheet.ciiva.com/22711/1915516-22711750.pdf?src-supplier=Element14; ComponentLink3Description: https://datasheet.ciiva.com/22711/1915516-22711750.pdf?src-supplier=Element14; ComponentLink4URL: https://datasheet.ciiva.com/11198/ds30036-11198999.pdf?src-supplier=Avnet; ComponentLink4Description: https://datasheet.ciiva.com/11198/ds30036-11198999.pdf?src-supplier=Avnet; ComponentLink5URL: https://datasheet.ciiva.com/6361/ds30036-6361256.pdf?src-supplier=Digi-Key; ComponentLink5Description: https://datasheet.ciiva.com/6361/ds30036-6361256.pdf?src-supplier=Digi-Key; ComponentLink6URL: https://datasheet.ciiva.com/6361/ds30036-6361254.pdf?src-supplier=Digi-Key; ComponentLink6Description: https://datasheet.ciiva.com/6361/ds30036-6361254.pdf?src-supplier=Digi-Key; Supplier Part Number 1: MMBT3904-FDICT-ND
R1 = RES_AXIAL_W: Resistor 5 Watt Cermet Wirewound Flameproof .27 Ohm 5% Axial Lead; Manufacturer: NTE Electronics; Manufacturer Part Number: 5WD27; this part is design: alperen; Power Rating: 5W; Temperature Coefficient: 300ppm/°C; Supplier 1: Allied Electronics; RoHS: Yes; Category: Through-Hole Resistors; Pricing 1: 1=0.42000, 50=0.41200, 100=0.39900 (USD); Mount: Through Hole; Case/Package: Axial; Min Operating Temperature: -55°C; Max Operating Temperature: 155°C; Termination: Axial; Tolerance: 5%; RoHS Compliant: No; ComponentLink1URL: https://datasheet.ciiva.com/15772/fivewire-15772442.pdf?src-supplier=Onlinecomponents.com; ComponentLink1Description: https://datasheet.ciiva.com/15772/fivewire-15772442.pdf?src-supplier=Onlinecomponents.com; Supplier Part Number 1: 70725300
R2 R4 = RES_1KOHM: Res Thin Film 0603 1K Ohm 0.1% 1/10W ±25ppm/°C Molded SMD SMD Punched Carrier T/R; this part is designed: alperen; Manufacturer: Panasonic; Manufacturer Part Number: ERA-3AEB102V; Power Rating: 100mW; Voltage Rating: 75V; Supplier 1: Digi-Key; RoHS: Yes; Category: Chip SMD Resistors; Stock 1: 5000; Pricing 1: 1=0.35000, 10=0.29900, 100=0.11670, 500=0.07056, 1000=0.04885, 2500=0.04478 (USD); Mount: Surface Mount; Case/Package: 0603; Number of Pins: 2; Case Code (Imperial): 0603; Case Code (Metric): 1608; Contact Plating: Tin; Size Code: 0603; Min Operating Temperature: -55°C; Max Operating Temperature: 155°C; Packaging: Tape and Reel; Temperature Coefficient: 25ppm/°C; Series: ERA-3A; Tolerance: 0.1%; Resistor Type: Thin Film; Number of Terminations: 2; Max Power Dissipation: 100mW; Construction: Rectangular; Features: Automotive AEC-Q200; Package Quantity: 5000; Termination: SMD/SMT; Resistance Tolerance: 0.1%; Technology: METAL FILM; Length: 1.6mm; Width: 0.8mm; Height: 0.45mm; Depth: 0.8mm; Ratings: AEC-Q200; Radiation Hardening: No; RoHS Compliant: Yes; Military Standard: Not; Reach SVHC Compliant: Yes; ComponentLink1URL: https://datasheet.ciiva.com/29183/450752-da-01-en-widerstand-0603-era-29183754.pdf?src-supplier=Conrad; ComponentLink1Description: https://datasheet.ciiva.com/29183/450752-da-01-en-widerstand-0603-era-29183754.pdf?src-supplier=Conrad; ComponentLink2URL: https://datasheet.ciiva.com/46393/1776116-46393695.pdf?src-supplier=Element14; ComponentLink2Description: https://datasheet.ciiva.com/46393/1776116-46393695.pdf?src-supplier=Element14; ComponentLink3URL: https://datasheet.ciiva.com/5734/aoa0000ce26-5734524.pdf?src-supplier=Farnell; ComponentLink3Description: https://datasheet.ciiva.com/5734/aoa0000ce26-5734524.pdf?src-supplier=Farnell; ComponentLink4URL: https://datasheet.ciiva.com/46422/1776116-46422455.pdf?src-supplier=Element14; ComponentLink4Description: https://datasheet.ciiva.com/46422/1776116-46422455.pdf?src-supplier=Element14; ComponentLink5URL: https://datasheet.ciiva.com/48530/era-eng-tds-48530582.pdf?src-supplier=Distrelec; ComponentLink5Description: https://datasheet.ciiva.com/48530/era-eng-tds-48530582.pdf?src-supplier=Distrelec; ComponentLink6URL: https://datasheet.ciiva.com/46422/485442-46422519.pdf?src-supplier=Element14; ComponentLink6Description: https://datasheet.ciiva.com/46422/485442-46422519.pdf?src-supplier=Element14; ComponentLink7URL: https://datasheet.ciiva.com/5734/485442-5734525.pdf?src-supplier=Farnell; ComponentLink7Description: https://datasheet.ciiva.com/5734/485442-5734525.pdf?src-supplier=Farnell; ComponentLink8URL: https://datasheet.ciiva.com/28531/485442-28531944.pdf?src-supplier=Element14; ComponentLink8Description: https://datasheet.ciiva.com/28531/485442-28531944.pdf?src-supplier=Element14; ComponentLink9URL: https://datasheet.ciiva.com/24071/aoa0000ce26-197354-24071510.pdf?src-supplier=Mouser; ComponentLink9Description: https://datasheet.ciiva.com/24071/aoa0000ce26-197354-24071510.pdf?src-supplier=Mouser; ComponentLink10URL: https://datasheet.ciiva.com/16781/70068849-16781703.pdf?src-supplier=Allied+Electronics; ComponentLink10Description: https://datasheet.ciiva.com/16781/70068849-16781703.pdf?src-supplier=Allied+Electronics; ComponentLink11URL: https://datasheet.ciiva.com/16725/70068849-16725038.pdf?src-supplier=Allied+Electronics; ComponentLink11Description: https://datasheet.ciiva.com/16725/70068849-16725038.pdf?src-supplier=Allied+Electronics; ComponentLink12URL: https://datasheet.ciiva.com/9198/aoa0000ce26-9198972.pdf?src-supplier=Avnet; ComponentLink12Description: https://datasheet.ciiva.com/9198/aoa0000ce26-9198972.pdf?src-supplier=Avnet; ComponentLink13URL: https://datasheet.ciiva.com/16426/aoa0000ce26-16426809.pdf?src-supplier=Future+Electronics; ComponentLink13Description: https://datasheet.ciiva.com/16426/aoa0000ce26-16426809.pdf?src-supplier=Future+Electronics; Supplier Part Number 1: P1.0KDBCT-ND
R3 R5 = RES 10KOHM 0603: RES SMD 10K OHM 1% 1/10W 0603; Manufacturer: Yageo; Manufacturer Part Number: RC0603FR-0710KL; this part is design: alperen; Voltage Rating: 75V; Power Rating: 100mW; Temperature Coefficient: 100ppm/°C; Voltage Rating (DC): 50V; Supplier 1: Digi-Key; RoHS: Yes; Category: Chip SMD Resistors; Stock 1: 41977694; Pricing 1: 1=0.10000, 10=0.01900, 100=0.00770, 1000=0.00345, 2500=0.00300 (USD); Case/Package: 0603; Number of Pins: 2; Case Code (Imperial): 0603; Case Code (Metric): 1608; Size Code: 0603; Weight: 7.1E-05oz; Min Operating Temperature: -55°C; Max Operating Temperature: 155°C; Packaging: Tape and Reel; Tolerance: 1%; Termination: SMD/SMT; Resistor Type: Thick Film; Series: RC; Features: Moisture Resistant; Max Power Dissipation: 100mW; Number of Terminations: 2; Resistance Tolerance: 1%; Construction: Rectangular; Length: 1.6mm; Width: 0.8mm; Height: 0.45mm; Depth: 0.8mm; Lead Pitch: 0.3mm; Lead Free: Lead Free; RoHS Compliant: Yes; Military Standard: Not; Reach SVHC Compliant: Yes; Supplier Part Number 1: 311-10.0KHRDKR-ND
RL1 RL2 = ALQ112: RELAY GEN PURPOSE SPDT 10A 12V; Manufacturer: Panasonic; this part is design: alperen; Voltage Rating (AC): 250V; Power Rating: 400mW; Coil Resistance: 360R; Coil Current: 33.3mA; Operate Time: 20ms; Coil Type: Non-Latching; Relay Type: General Purpose; Supplier 1: Digi-Key; Manufacturer Part Number: ALQ112; RoHS: Yes; Category: Power Relays; Stock 1: 24805; Pricing 1: 1=1.42000, 10=1.33600, 25=1.18720, 50=1.12780, 100=1.06850, 250=0.94976, 500=0.89040, 1000=0.83104, 5000=0.80136 (USD); Number of Pins: 5; Contact Material: Silver; Weight: 7g; Min Operating Temperature: -40°C; Max Operating Temperature: 85°C; Contact Current Rating: 10A; Package Quantity: 100; Packaging: Carton; Power Consumption: 400mW; Throw Configuration: SPDT; Termination: PC Pin; Release Time: 20ms; Coil Power: 400mW; Max Voltage Rating (AC): 250V; Coil Voltage (DC): 12V; Series: ALQ; Length: 20mm; Width: 10mm; Height: 16mm; Depth: 10mm; Lead Free: Lead Free; RoHS Compliant: Yes; ComponentLink1URL: https://datasheet.ciiva.com/24388/307ds-61b20-en-lq-24388909.pdf?src-supplier=Onlinecomponents.com; ComponentLink1Description: https://datasheet.ciiva.com/24388/307ds-61b20-en-lq-24388909.pdf?src-supplier=Onlinecomponents.com; Supplier Part Number 1: 255-3562-ND; Case/Package: ALQ112
T1 = BV302S12010-ZU: BV Series Single 230 Vin Single Out 125 mA Sealed Power Transformer; Manufacturer: Zettler Magnetics; Manufacturer Part Number: BV302S12015-ZU; this part is design: alperen; Current Rating: 125mA; Turns Ratio: 19:1; Primary Voltage: 230; Secondary Vpoltage: 12; Operating Frequency: 50-60Hz; Rated Power: 1VA; Supplier 1: Future Electronics; RoHS: Yes; Stock 1: 10; Pricing 1: 1=1.79000, 30=1.74000, 100=1.69000, 250=1.65000, 750=1.57000 (USD); Lead Free: Lead Free; ComponentLink1URL: http://www1.futureelectronics.com/doc/ZETTLER%20MAGNETICS/BV302S12015.pdf?src-supplier=Future+Electronics; ComponentLink1Description: http://www1.futureelectronics.com/doc/ZETTLER%20MAGNETICS/BV302S12015.pdf?src-supplier=Future+Electronics; Supplier Part Number 1: 8978579
U1 = LM2675MX-12/NOPB: SIMPLE SWITCHER® 6.5V to 40V, 1A Low Component Count Step-Down Regulator 8-SOIC -40 to 125; Manufacturer: TI National Semiconductor; this part is design: alperen; Number of Outputs: 1; Output Voltage: 12V; Efficiency: 94%; Min Input Voltage: 8V; Switching Frequency: 260kHz; Synchronous Rectifier: No; Quiescent Current: 2.5mA; Output Type: Fixed; Supplier 1: Digi-Key; Manufacturer Part Number: LM2675MX-12/NOPB; RoHS: Yes; Category: Voltage Regulators - Switching; Pricing 1: 1=4.94000, 10=4.44000, 25=4.19760, 100=3.63790, 250=3.45136, 500=3.09690, 1000=2.64000 (USD); Mount: Surface Mount; Case/Package: SOIC N; Number of Pins: 8; Contact Plating: Tin; Min Operating Temperature: -40°C; Max Operating Temperature: 125°C; Output Current: 1A; Packaging: Tape and Reel; Max Output Current: 1A; Max Input Voltage: 40V; Package Quantity: 2500; Operating Supply Voltage: 40V; Series: LM2675; Radiation Hardening: No; Lead Free: Lead Free; RoHS Compliant: Yes; ComponentLink1URL: https://datasheet.ciiva.com/41457/001013881-da-01-en-ic-reg-buck-lm2675mx-12-nopb-soic-8-tid-41457896.pdf?src-supplier=Conrad; ComponentLink1Description: https://datasheet.ciiva.com/41457/001013881-da-01-en-ic-reg-buck-lm2675mx-12-nopb-soic-8-tid-41457896.pdf?src-supplier=Conrad; ComponentLink2URL: https://datasheet.ciiva.com/3220/lm2675-3220840.pdf?src-supplier=Avnet; ComponentLink2Description: https://datasheet.ciiva.com/3220/lm2675-3220840.pdf?src-supplier=Avnet; Supplier Part Number 1: 296-35410-1-ND
U2 = AP7361-33E-13: AP7361 Series 3.3 V 1 A Low SMT Dropout Fixed-Mode Regulator - SOT-223; this part is design: alperen; Manufacturer: Diodes; Number of Outputs: 1; Min Input Voltage: 2.2V; Max Input Voltage: 6V; Max Output Current: 1A; Output Voltage: 3.3V; Max Power Dissipation: 1.1W; Dropout Voltage: 500mV; Min Current Limit: 1.1A; Polarity: Positive; Quiescent Current: 70uA; Power Dissipation: 1.1kW; Accuracy: 1%; Power Supply Rejection Ratio (PSRR): 65dB; Reference Voltage: 800mV; Output Type: Fixed; Supplier 1: Digi-Key; RoHS: Yes; Category: Voltage Regulators - Linear; Pricing 1: 1=0.54000, 10=0.43400, 25=0.39760, 100=0.29580, 250=0.26804, 500=0.22184, 1000=0.16638 (USD); Mount: Surface Mount; Case/Package: SOT-223; Number of Pins: 4; Weight: 0.000282oz; Contact Plating: Tin,Matte; Min Operating Temperature: -40°C; Max Operating Temperature: 85°C; Package Quantity: 1; Packaging: Tape and Reel; Output Current: 1A; Number of Regulators: 1; Series: -; Radiation Hardening: No; Reach SVHC Compliant: Yes; Lead Free: Lead Free; RoHS Compliant: Yes; ComponentLink1URL: https://datasheet.ciiva.com/26926/getdatasheetpartid-670786-26926141.pdf?src-supplier=Verical; ComponentLink1Description: https://datasheet.ciiva.com/26926/getdatasheetpartid-670786-26926141.pdf?src-supplier=Verical; ComponentLink2URL: https://datasheet.ciiva.com/25651/ap7361-25651049.pdf?src-supplier=Digi-Key; ComponentLink2Description: https://datasheet.ciiva.com/25651/ap7361-25651049.pdf?src-supplier=Digi-Key; ComponentLink3URL: https://datasheet.ciiva.com/29568/ap7361-29568378.pdf?src-supplier=Digi-Key; ComponentLink3Description: https://datasheet.ciiva.com/29568/ap7361-29568378.pdf?src-supplier=Digi-Key; ComponentLink4URL: https://datasheet.ciiva.com/29568/ap7361-29568379.pdf?src-supplier=Digi-Key; ComponentLink4Description: https://datasheet.ciiva.com/29568/ap7361-29568379.pdf?src-supplier=Digi-Key; Manufacturer Part Number: AP7361-33E-13; Supplier Part Number 1: AP7361-33E-13DICT-ND

## Nets that join several sheets
3.3VDC: Microcontroller (26 pins), POWER_Manegement (8 pins)
5VDC: Microcontroller (BZ1.2 C24.1), POWER_Manegement (9 pins)
GND: Microcontroller (35 pins), POWER_Manegement (28 pins)
LED DRIVER: Microcontroller (U7.21), POWER_Manegement (J8.3)
NetJ8_5: Microcontroller (U7.22), POWER_Manegement (J8.5)
NetR2_1: Microcontroller (U7.41), POWER_Manegement (R2.1)
NetR4_1: Microcontroller (U7.40), POWER_Manegement (R4.1)
SWCLK: Microcontroller (U7.37), POWER_Manegement (J7.3)
SWDIO: Microcontroller (U7.34), POWER_Manegement (J7.2)
TDI: Microcontroller (U7.38), POWER_Manegement (J7.4)
TEMPERATURE_ADC: Microcontroller (U7.19), POWER_Manegement (J8.4)
USB_N: Microcontroller (R17.2 U6.1 U6.6), POWER_Manegement (J3.2)
USB_P: Microcontroller (R18.2 U6.3 U6.4), POWER_Manegement (J3.3)